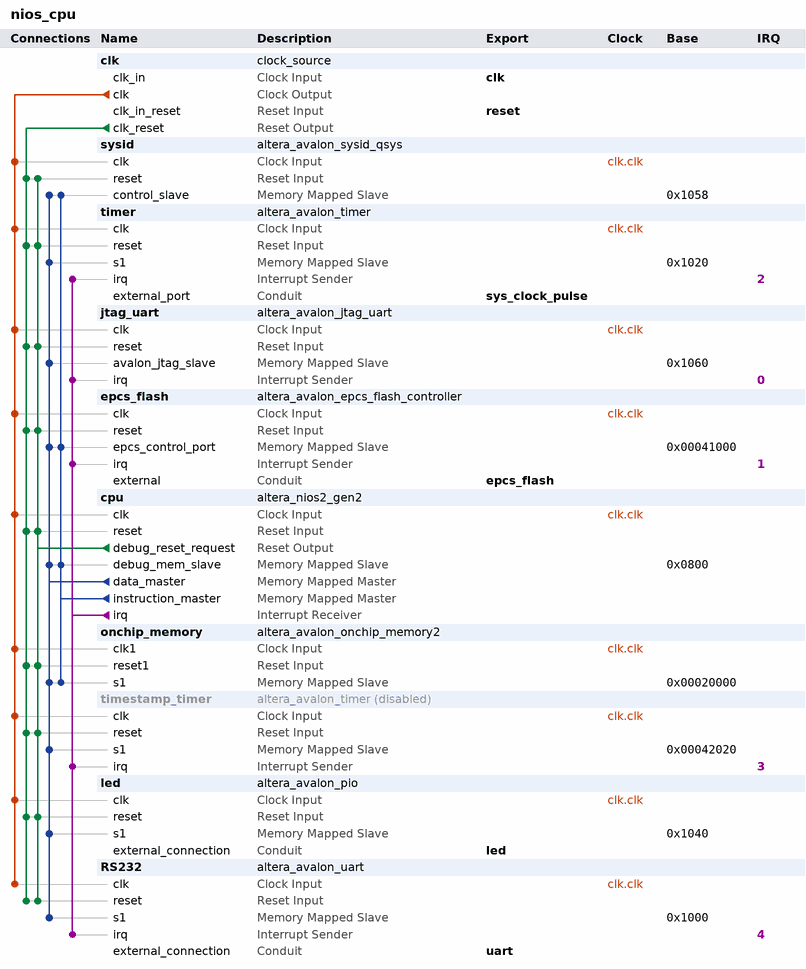
[diagram p0: system contents]
# Platform Designer (Qsys) system nios_cpu, Cyclone IV E EP4CE75F23C8
# Parameters at their usual value, and those the tool derives, are not listed.
package require -exact qsys 18.0
create_system nios_cpu
set_project_property DEVICE_FAMILY {Cyclone IV E}
set_project_property DEVICE EP4CE75F23C8

add_instance clk clock_source 18.0
set_instance_parameter_value clk clockFrequency 100000000

add_instance sysid altera_avalon_sysid_qsys 18.0
set_instance_parameter_value sysid id 74565

add_instance timer altera_avalon_timer 18.0
set_instance_parameter_value timer period 1
set_instance_parameter_value timer periodUnits MSEC
set_instance_parameter_value timer timeoutPulseOutput true

add_instance jtag_uart altera_avalon_jtag_uart 18.0
set_instance_parameter_value jtag_uart simInteractiveOptions NO_INTERACTIVE_WINDOWS

add_instance epcs_flash altera_avalon_epcs_flash_controller 18.0
set_instance_parameter_value epcs_flash resetrequest_enabled true

add_instance cpu altera_nios2_gen2 18.0
set_instance_parameter_value cpu dcache_size 0
set_instance_parameter_value cpu dividerType srt2
set_instance_parameter_value cpu exceptionSlave onchip_memory.s1
set_instance_parameter_value cpu icache_size 4096
set_instance_parameter_value cpu impl Fast
set_instance_parameter_value cpu resetSlave onchip_memory.s1
set_instance_parameter_value cpu setting_activateTrace true

add_instance onchip_memory altera_avalon_onchip_memory2 18.0
set_instance_parameter_value onchip_memory dataWidth 32
set_instance_parameter_value onchip_memory dualPort false
set_instance_parameter_value onchip_memory initMemContent true
set_instance_parameter_value onchip_memory initializationFileName onchip_mem.hex
set_instance_parameter_value onchip_memory memorySize 98304

add_instance timestamp_timer altera_avalon_timer 18.0
set_instance_property timestamp_timer ENABLED false
set_instance_parameter_value timestamp_timer period 1
set_instance_parameter_value timestamp_timer periodUnits MSEC

add_instance led altera_avalon_pio 18.0
set_instance_parameter_value led direction Output
set_instance_parameter_value led width 4

add_instance RS232 altera_avalon_uart 18.0
set_instance_parameter_value RS232 baud 115200
set_instance_parameter_value RS232 dataBits 8
set_instance_parameter_value RS232 fixedBaud true
set_instance_parameter_value RS232 parity NONE
set_instance_parameter_value RS232 stopBits 1

# connections
add_connection clk.clk cpu.clk clock
add_connection clk.clk epcs_flash.clk clock
add_connection clk.clk jtag_uart.clk clock
add_connection clk.clk led.clk clock
add_connection clk.clk onchip_memory.clk1 clock
add_connection clk.clk RS232.clk clock
add_connection clk.clk sysid.clk clock
add_connection clk.clk timer.clk clock
add_connection clk.clk timestamp_timer.clk clock
add_connection clk.clk_reset cpu.reset reset
add_connection clk.clk_reset epcs_flash.reset reset
add_connection clk.clk_reset jtag_uart.reset reset
add_connection clk.clk_reset led.reset reset
add_connection clk.clk_reset onchip_memory.reset1 reset
add_connection clk.clk_reset RS232.reset reset
add_connection clk.clk_reset sysid.reset reset
add_connection clk.clk_reset timer.reset reset
add_connection clk.clk_reset timestamp_timer.reset reset
add_connection cpu.debug_reset_request cpu.reset reset
add_connection cpu.debug_reset_request epcs_flash.reset reset
add_connection cpu.debug_reset_request jtag_uart.reset reset
add_connection cpu.debug_reset_request led.reset reset
add_connection cpu.debug_reset_request onchip_memory.reset1 reset
add_connection cpu.debug_reset_request RS232.reset reset
add_connection cpu.debug_reset_request sysid.reset reset
add_connection cpu.debug_reset_request timer.reset reset
add_connection cpu.debug_reset_request timestamp_timer.reset reset
add_connection cpu.data_master cpu.debug_mem_slave avalon
set_connection_parameter_value cpu.data_master/cpu.debug_mem_slave baseAddress 0x0800
add_connection cpu.data_master epcs_flash.epcs_control_port avalon
set_connection_parameter_value cpu.data_master/epcs_flash.epcs_control_port baseAddress 0x00041000
add_connection cpu.data_master jtag_uart.avalon_jtag_slave avalon
set_connection_parameter_value cpu.data_master/jtag_uart.avalon_jtag_slave baseAddress 0x1060
add_connection cpu.data_master led.s1 avalon
set_connection_parameter_value cpu.data_master/led.s1 baseAddress 0x1040
add_connection cpu.data_master onchip_memory.s1 avalon
set_connection_parameter_value cpu.data_master/onchip_memory.s1 baseAddress 0x00020000
add_connection cpu.data_master RS232.s1 avalon
set_connection_parameter_value cpu.data_master/RS232.s1 baseAddress 0x1000
add_connection cpu.data_master sysid.control_slave avalon
set_connection_parameter_value cpu.data_master/sysid.control_slave baseAddress 0x1058
add_connection cpu.data_master timer.s1 avalon
set_connection_parameter_value cpu.data_master/timer.s1 baseAddress 0x1020
add_connection cpu.data_master timestamp_timer.s1 avalon
set_connection_parameter_value cpu.data_master/timestamp_timer.s1 baseAddress 0x00042020
add_connection cpu.instruction_master cpu.debug_mem_slave avalon
set_connection_parameter_value cpu.instruction_master/cpu.debug_mem_slave baseAddress 0x0800
add_connection cpu.instruction_master epcs_flash.epcs_control_port avalon
set_connection_parameter_value cpu.instruction_master/epcs_flash.epcs_control_port baseAddress 0x00041000
add_connection cpu.instruction_master onchip_memory.s1 avalon
set_connection_parameter_value cpu.instruction_master/onchip_memory.s1 baseAddress 0x00020000
add_connection cpu.instruction_master sysid.control_slave avalon
set_connection_parameter_value cpu.instruction_master/sysid.control_slave baseAddress 0x1058
add_connection cpu.irq epcs_flash.irq interrupt
set_connection_parameter_value cpu.irq/epcs_flash.irq irqNumber 1
add_connection cpu.irq jtag_uart.irq interrupt
set_connection_parameter_value cpu.irq/jtag_uart.irq irqNumber 0
add_connection cpu.irq RS232.irq interrupt
set_connection_parameter_value cpu.irq/RS232.irq irqNumber 4
add_connection cpu.irq timer.irq interrupt
set_connection_parameter_value cpu.irq/timer.irq irqNumber 2
add_connection cpu.irq timestamp_timer.irq interrupt
set_connection_parameter_value cpu.irq/timestamp_timer.irq irqNumber 3

# exported interfaces
add_interface clk clock sink
set_interface_property clk EXPORT_OF clk.clk_in
add_interface epcs_flash conduit end
set_interface_property epcs_flash EXPORT_OF epcs_flash.external
add_interface led conduit end
set_interface_property led EXPORT_OF led.external_connection
add_interface reset reset sink
set_interface_property reset EXPORT_OF clk.clk_in_reset
add_interface sys_clock_pulse conduit end
set_interface_property sys_clock_pulse EXPORT_OF timer.external_port
add_interface uart conduit end
set_interface_property uart EXPORT_OF RS232.external_connection

set_interconnect_requirement {$system} qsys_mm.clockCrossingAdapter HANDSHAKE
set_interconnect_requirement {$system} qsys_mm.maxAdditionalLatency 1

save_system nios_cpu.qsys
